# EAGLE design coreless (EAGLE 8.3.1)
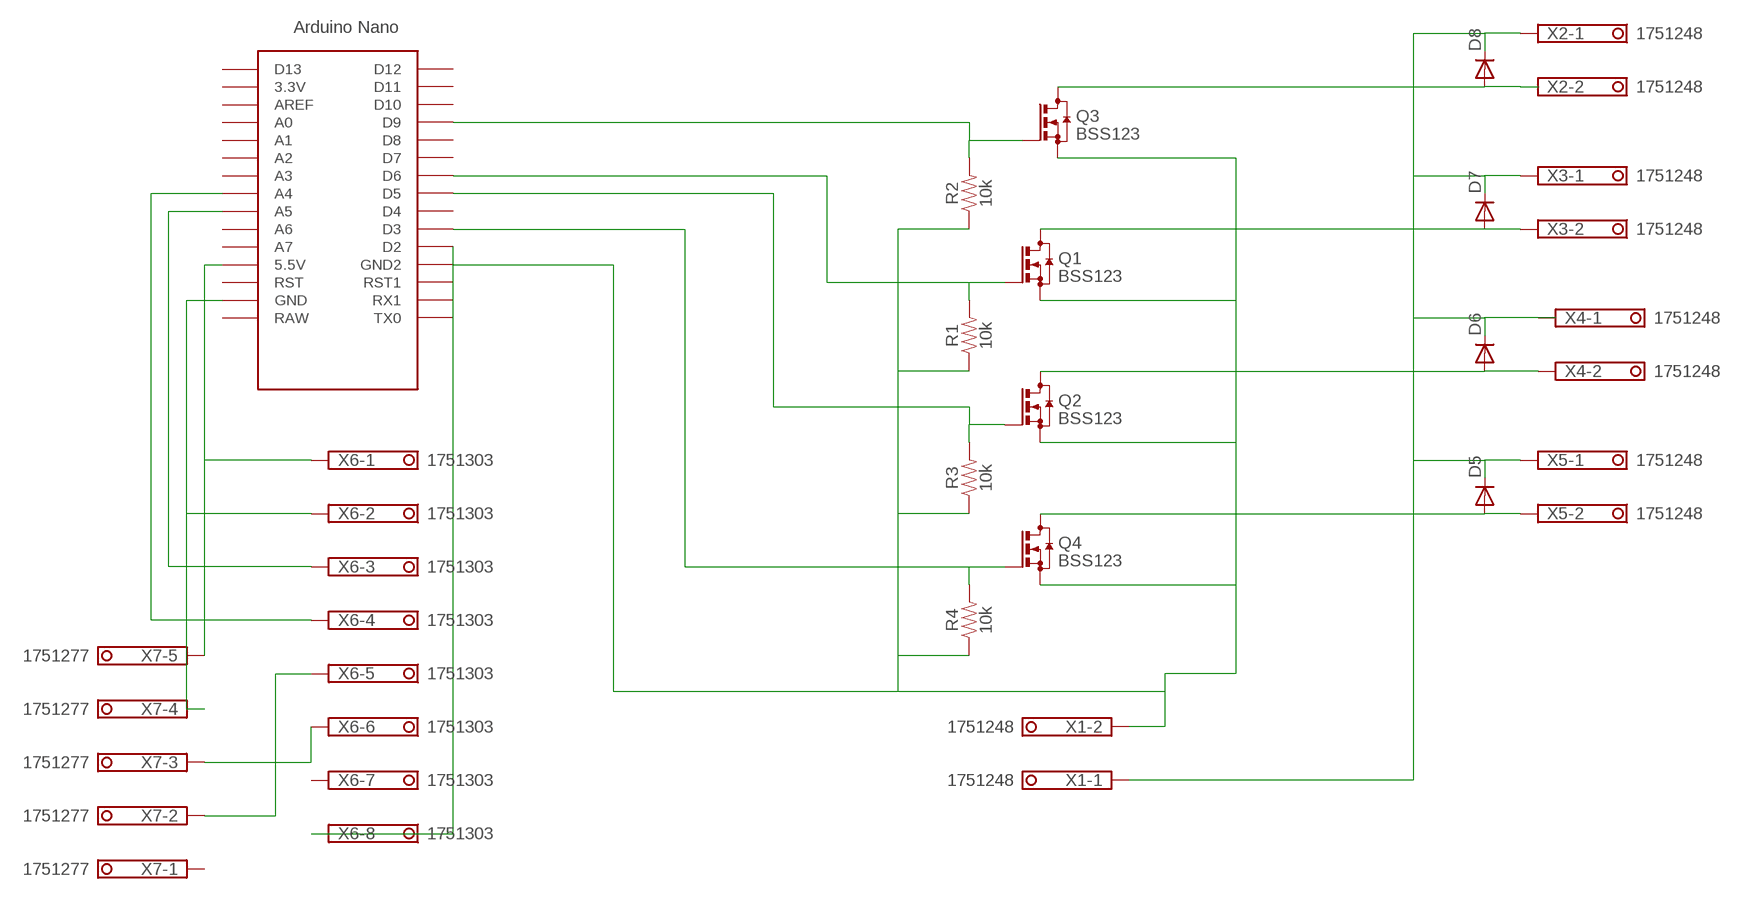
[diagram p0: schematic, sheet 1]

## Parts
D5  DIODE-DO-214AC  [DO-214AC]
D6  DIODE-DO-214AC  [DO-214AC]
D7  DIODE-DO-214AC  [DO-214AC]
D8  DIODE-DO-214AC  [DO-214AC]
Q1  BSS123  [SOT23]
Q2  BSS123  [SOT23]
Q3  BSS123  [SOT23]
Q4  BSS123  [SOT23]
R1  10k  10KOHM-0603-1/10W-1%  [0603]
R2  10k  10KOHM-0603-1/10W-1%  [0603]
R3  10k  10KOHM-0603-1/10W-1%  [0603]
R4  10k  10KOHM-0603-1/10W-1%  [0603]
U$1  NANO  [NANO]
X1  1751248  [1751248]
X2  1751248  [1751248]
X3  1751248  [1751248]
X4  1751248  [1751248]
X5  1751248  [1751248]
X6  1751303  [1751303]
X7  1751277  [1751277]

## Nets
N$1: Q1.2(S) Q2.2(S) Q3.2(S) Q4.2(S) R1.1 R2.1 R3.1 R4.1 U$1.GND1(GND2) X1.2
N$2: D8.A Q3.3(D) X2.2
N$4: Q3.1(G) R2.2 U$1.D9
N$5: D7.A Q1.3(D) X3.2
N$6: Q1.1(G) R1.2 U$1.D6
N$7: D6.A Q2.3(D) X4.2
N$8: Q2.1(G) R3.2 U$1.D5
N$9: D5.A Q4.3(D) X5.2
N$10: Q4.1(G) R4.2 U$1.D3
N$11: U$1.5V(5.5V) X6.1 X7.5
N$12: U$1.GND X6.2 X7.4
N$13: U$1.A5 X6.3
N$14: U$1.A4 X6.4
N$15: U$1.D2 X6.8
N$16: X6.5 X7.2
N$17: X6.6 X7.3
N$18: D5.C D6.C D7.C D8.C X1.1 X2.1 X3.1 X4.1 X5.1
Unconnected: U$1.3.3V U$1.A0 U$1.A1 U$1.A2 U$1.A3 U$1.A6 U$1.A7 U$1.AREF U$1.D4 U$1.D7 U$1.D8 U$1.D10 U$1.D11 U$1.D12 U$1.D13 U$1.ICSP1 U$1.ICSP2 U$1.ICSP3 U$1.ICSP4 U$1.ICSP5 U$1.ICSP6 U$1.RAW U$1.RST U$1.RST1 U$1.RX1 U$1.TX0 X6.7 X7.1

## Library data of the parts
D5-D8 = diode:DIODE-: DIODE
Q1-Q4 = transistor-small-signal:BSS123: N-CHANNEL MOS FET
R1-R4 = SparkFun-Resistors:10KOHM: 10kΩ resistor A resistor is a passive two-terminal electrical component that implements electrical resistance as a circuit element. Resistors act to reduce current flow, and, at the same time, act to lower voltage levels within circuits. - Wikipedia; PROD_ID: RES-00824
U$1 = Arduino-clone:NANO: Arduino Nano
X1-X5 = con-phoenix-350:1751248: MKDS 1/ 2-3,5 Printklemme Nennstrom: 10 A Bemessungsspannung: 160 V Raster: 3,5 mm Polzahl: 2 Montageart: Löten Anschlussart: Schraubanschluss Anschlussrichtung vom Leiter zur Platine: 0° Source: http://eshop.phoenixcontact.com .. 1751248.pdf; OC_FARNELL: unknown; OC_NEWARK: unknown
X6 = con-phoenix-350:1751303: MKDS 1/ 8-3,5 Printklemme Nennstrom: 10 A Bemessungsspannung: 160 V Raster: 3,5 mm Polzahl: 8 Montageart: Löten Anschlussart: Schraubanschluss Anschlussrichtung vom Leiter zur Platine: 0° Source: http://eshop.phoenixcontact.com .. .pdf; OC_FARNELL: unknown; OC_NEWARK: unknown
X7 = con-phoenix-350:1751277: MKDS 1/ 5-3,5 Printklemme Nennstrom: 10 A Bemessungsspannung: 160 V Raster: 3,5 mm Polzahl: 5 Montageart: Löten Anschlussart: Schraubanschluss Anschlussrichtung vom Leiter zur Platine: 0° Source: http://eshop.phoenixcontact.com .. 1751277.pdf; OC_FARNELL: unknown; OC_NEWARK: unknown

## Board
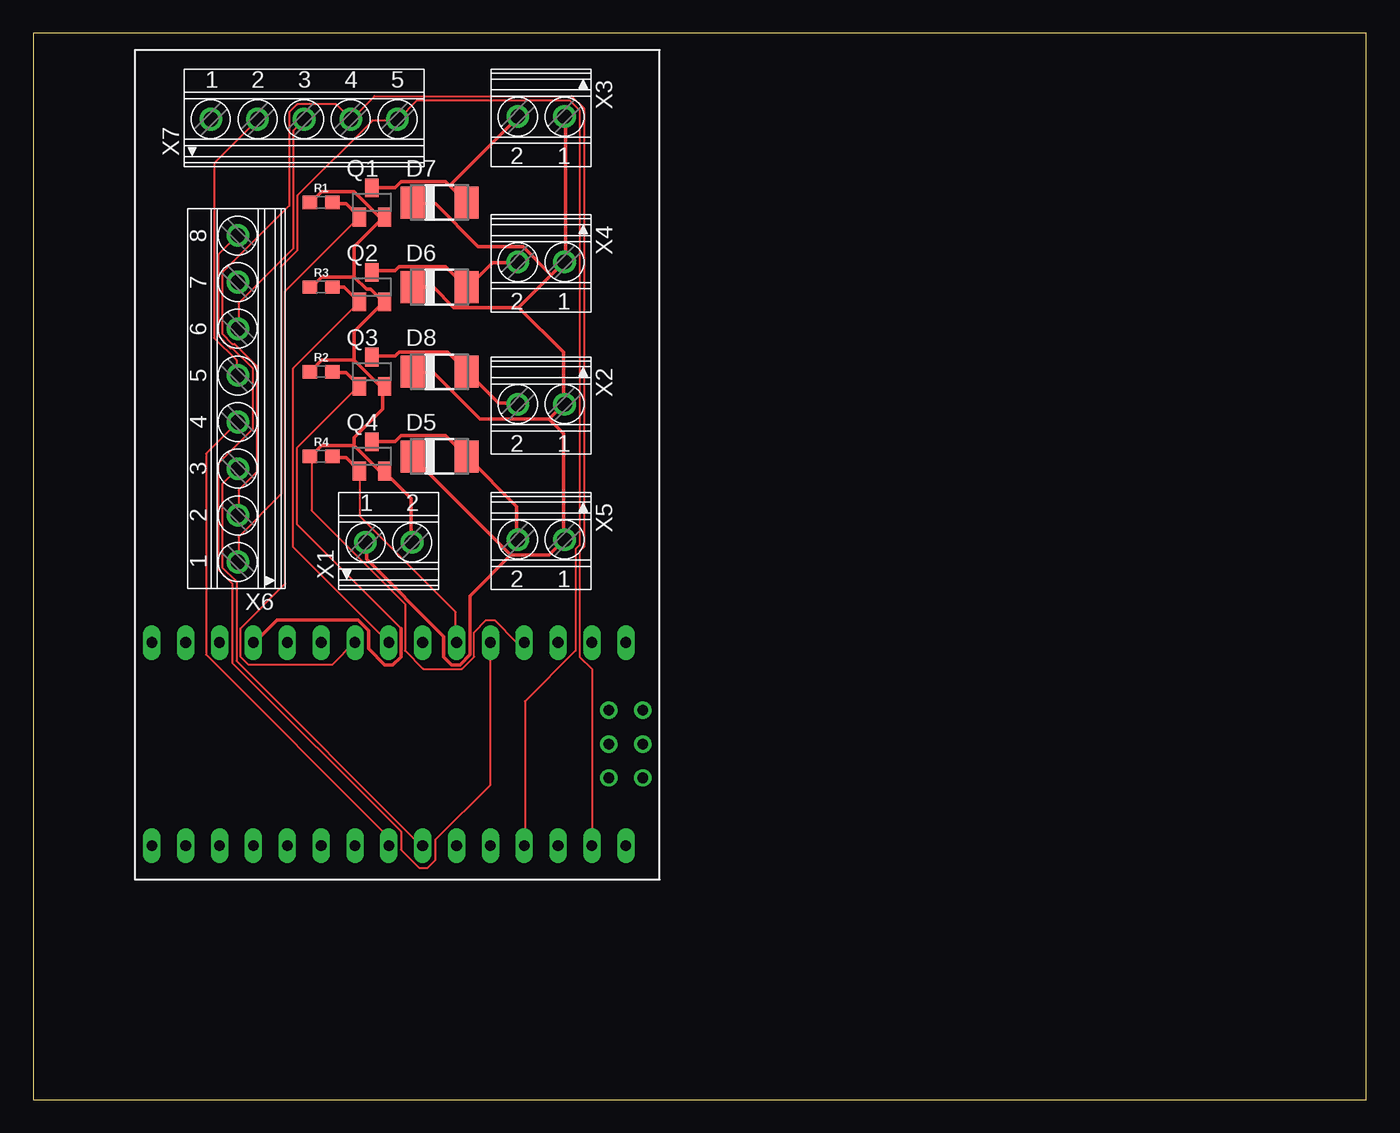
[diagram p1: board, top side]

Size 100 x 80 mm. Coordinates in mm from the lower left corner, seen from the top.
Outline: 0,0 100,0 100,80 0,80 0,0
Copper layers (1*16): Top 0.035mm / dielectric 1.5mm / Bottom 0.035mm
Design rules "default": minimum track width 6mil, minimum drill 0.35mm, track to track 6mil, track to pad 6mil, pad to pad 6mil, via to via 6mil, smd to smd 6mil, copper to edge 40mil, drill to drill 6mil, minimum pad ring 10mil, minimum via ring 8mil, stop-mask expansion 4mil, vias tented up to drill 0mil, thermal gap 10mil

### Footprints (pad centres in the part's own frame; a part is rotated, then mirrored left to right if it is on the bottom)
DO-214AC = smd 1.8 x 2.4: A 2.025,0; C -2.025,0
SOT23 = smd 1 x 1.4: 1 -0.95,-1.1; 2 0.95,-1.1; 3 0,1.1
0603 = smd 1.1 x 1: 1 -0.85,0; 2 0.85,0
NANO = drill 0.8 long: 3.3V -10.16,24.13; 5V -10.16,-1.27; A0 -10.16,19.05; A1 -10.16,16.51; A2 -10.16,13.97; A3 -10.16,11.43; A4 -10.16,8.89; A5 -10.16,6.35; A6 -10.16,3.81; A7 -10.16,1.27; AREF -10.16,21.59; D2 5.08,1.27; D3 5.08,3.81; D4 5.08,6.35; D5 5.08,8.89; D6 5.08,11.43; D7 5.08,13.97; D8 5.08,16.51; D9 5.08,19.05; D10 5.08,21.59; D11 5.08,24.13; D12 5.08,26.67; D13 -10.16,26.67; GND -10.16,-6.35; GND1 5.08,-1.27; RAW -10.16,-8.89; RST -10.16,-3.81; RST1 5.08,-3.81; RX1 5.08,-6.35; TX0 5.08,-8.89 | drill 0.8: ICSP1 -5.08,-10.16; ICSP2 -5.08,-7.62; ICSP3 -2.54,-10.16; ICSP4 -2.54,-7.62; ICSP5 0,-10.16; ICSP6 0,-7.62
1751248 = drill 1.1 pad 1.7: 1 -1.75,-0.1; 2 1.75,-0.1
1751303 = drill 1.1 pad 1.7: 1 -12.25,-0.1; 2 -8.75,-0.1; 3 -5.25,-0.1; 4 -1.75,-0.1; 5 1.75,-0.1; 6 5.25,-0.1; 7 8.75,-0.1; 8 12.25,-0.1
1751277 = drill 1.1 pad 1.7: 1 -7,-0.1; 2 -3.5,-0.1; 3 0,-0.1; 4 3.5,-0.1; 5 7,-0.1

### Placement (x,y rotation side)
D5  30.48,48.26 0 top
D6  30.48,60.96 0 top
D7  30.48,67.31 0 top
D8  30.48,54.61 0 top
Q1  25.4,67.31 0 top
Q2  25.4,60.96 0 top
Q3  25.4,54.61 0 top
Q4  25.4,48.26 0 top
R1  21.59,67.31 0 top
R2  21.59,54.61 0 top
R3  21.59,60.96 0 top
R4  21.59,48.26 0 top
U$1  35.56,29.21 90 top
X1  26.67,41.91 0 top
X2  38.1,52.07 180 top
X3  38.1,73.66 180 top
X4  38.1,62.74 180 top
X5  38.1,41.91 180 top
X6  15.24,52.58 90 top
X7  20.32,73.66 0 top

### Tracks (layer width: path | path; a pad name or v marks a point on that pad's centre or on a via)
N$1
  Top 0.152: 25.91,53.65 26.21,53.65 Q3.2 26.21,53.49 | 20.88,54.71 R2.1 | 20.88,60.96 R3.1 | 26.21,59.89 Q2.2 26.21,59.74 | 25.91,66.29 26.21,66.29 Q1.2 26.21,66.14 | 20.88,67.36 R1.1 | 25.91,47.24 26.21,47.24 Q4.2 26.36,47.09 | 20.88,48.31 R4.1 20.88,48.16 20.88,44.2 27.89,37.19 27.89,33.68 29.26,32.31 32.16,32.31 33.07,33.22 33.07,35.05 33.98,35.97 34.59,35.97 36.27,34.29 U$1.GND1 | 28.35,41.91 X1.2
  Top 0.254: 20.88,54.71 21.64,55.47 24.08,55.47 | 25.91,53.65 24.08,55.47 | 20.88,60.96 21.64,61.72 24.08,61.72 | 24.08,61.72 24.99,60.81 25.3,60.81 26.21,59.89 | 20.88,67.36 21.64,68.12 24.08,68.12 25.91,66.29 | 24.08,61.72 24.08,64.01 26.21,66.14 | 24.08,55.47 24.08,57.61 26.21,59.74 | 20.88,48.31 21.64,49.07 24.08,49.07 | 25.91,47.24 24.08,49.07 | 28.35,41.91 28.35,45.11 26.36,47.09 | 26.21,53.49 26.21,51.82 24.08,49.68 24.08,49.07
N$2
  Top 0.152: 25.45,55.78 Q3.3 | 32.46,54.71 D8.A 32.61,54.56
  Top 0.254: 25.45,55.78 27.13,55.78 27.43,56.08 31.09,56.08 32.46,54.71 | 32.61,54.56 34.9,52.27 36.27,52.27 X2.2
N$4
  Top 0.152: 22.55,54.56 R2.2 | 24.38,53.65 Q3.1 24.38,53.49 19.81,48.92 19.81,43.13 27.58,35.36 | 16.61,34.29 U$1.D9
  Top 0.254: 22.55,54.56 23.47,54.56 24.38,53.65 | 27.58,35.36 27.58,33.22 26.98,32.61 26.36,32.61 25.15,33.83 25.15,35.2 24.38,35.97 18.29,35.97 16.61,34.29
N$5
  Top 0.152: 25.45,68.43 Q1.3 | 32.46,67.36 D7.A
  Top 0.254: 25.45,68.43 27.13,68.43 27.58,68.89 30.94,68.89 31.24,68.58 | 32.46,67.36 31.24,68.58 | 31.24,68.58 36.27,73.61 X3.2
N$6
  Top 0.152: 22.55,67.21 R1.2 | 24.38,66.29 Q1.1 24.38,66.14 18.9,60.66 18.9,38.71 15.54,35.36 15.54,33.22 16.15,32.61 22.4,32.61 24.08,34.29 U$1.D6
  Top 0.254: 22.55,67.21 23.47,67.21 24.38,66.29
N$7
  Top 0.152: 25.45,62.18 Q2.3 | 32.46,60.96 D6.A 32.61,60.96 | 36.27,62.79 X4.2
  Top 0.254: 25.45,62.18 27.13,62.18 27.43,62.48 30.94,62.48 32.46,60.96 | 36.27,62.79 34.44,62.79 32.61,60.96
N$8
  Top 0.152: 24.38,59.89 Q2.1 24.38,59.74 19.51,54.86 19.51,41.45 U$1.D5
  Top 0.254: R3.2 23.32,60.96 24.38,59.89
N$9
  Top 0.152: 25.45,49.38 Q4.3 | 32.46,48.31 D5.A 32.61,48.16 | 36.27,42.06 X5.2
  Top 0.254: 25.45,49.38 27.13,49.38 27.58,49.84 30.94,49.84 32.46,48.31 | 36.27,42.06 36.27,44.5 32.61,48.16
N$10
  Top 0.152: 22.55,48.16 R4.2 | 24.38,47.24 Q4.1 24.54,47.09 24.54,43.74 31.7,36.58 31.7,34.29 U$1.D3
  Top 0.254: 22.55,48.16 23.47,48.16 24.38,47.24
N$11
  Top 0.152: U$1.5V 36.88,19.05 36.88,29.87 40.69,33.68 40.69,41.3 41,41.6 41,74.22 40.23,74.98 28.8,74.98 27.43,73.61 X7.5 27.28,73.46 25.45,73.46 19.81,67.82 19.81,63.7 18.59,62.48 18.59,45.41 15.39,42.22 15.39,40.39 X6.1
N$12
  Top 0.152: U$1.GND 41.91,32.31 41,33.22 41,41.15 41.3,41.45 41.3,74.37 40.39,75.29 25.6,75.29 23.93,73.61 X7.4 23.77,73.61 22.71,74.68 19.81,74.68 19.2,74.07 19.2,67.06 14.17,62.03 14.17,57.45 14.94,56.69 15.09,56.69 16.76,55.02 16.76,47.09 15.39,45.72 15.39,43.89 X6.2
N$13
  Top 0.152: U$1.A5 29.11,19.05 15.24,32.92 15.24,38.86 14.17,39.93 14.17,46.18 15.24,47.24 X6.3
N$14
  Top 0.152: U$1.A4 26.67,19.66 12.95,33.38 12.95,48.46 15.24,50.75 X6.4
N$15
  Top 0.152: U$1.D2 34.29,23.62 30.18,19.51 30.18,17.98 29.57,17.37 28.96,17.37 27.58,18.75 27.58,20.12 14.94,32.77 14.94,38.71 13.87,39.78 13.87,47.7 16.46,50.29 16.46,54.86 14.94,56.39 14.78,56.39 13.87,57.3 13.87,63.4 15.24,64.77 X6.8
N$16
  Top 0.152: X6.5 15.24,54.41 15.24,55.47 13.56,57.15 13.56,70.26 16.76,73.46 X7.2
N$17
  Top 0.152: X6.6 15.39,57.91 15.39,59.74 19.51,63.86 19.51,72.69 20.27,73.46 X7.3
N$18
  Top 0.152: 28.5,48.16 D5.C | 39.78,41.91 X5.1 39.78,42.06 | 28.5,54.56 D8.C | 39.78,52.12 X2.1 39.78,52.27 | 39.78,62.79 X4.1 39.93,62.94 | 28.5,67.21 D7.C
  Top 0.254: 35.81,40.84 28.5,48.16 | 35.81,40.84 38.71,40.84 39.78,41.91 | 35.81,40.84 32.77,37.8 32.77,33.38 32,32.61 31.39,32.61 30.79,33.22 30.79,34.75 24.99,40.54 24.99,41.76 X1.1 | 28.5,54.56 30.02,54.56 33.53,51.05 38.71,51.05 | 39.78,52.12 38.71,51.05 | D6.C 30.02,60.96 31.55,59.44 36.42,59.44 | 39.78,62.79 38.86,61.87 | 38.86,61.87 36.42,59.44 | 28.5,67.21 30.18,67.21 33.38,64.01 36.73,64.01 38.86,61.87 | 39.93,62.94 39.93,73.61 X3.1 | 39.78,52.27 39.78,56.08 36.42,59.44 | 39.78,42.06 39.78,49.99 38.71,51.05